# EasyEDA schematic Monitoring System_schematics.json
TITLE: Sheet_2; REV: 1.0; Date: 2024-05-09; Sheet: 1/1; Drawn By: martin.tab24; Company: Your Company
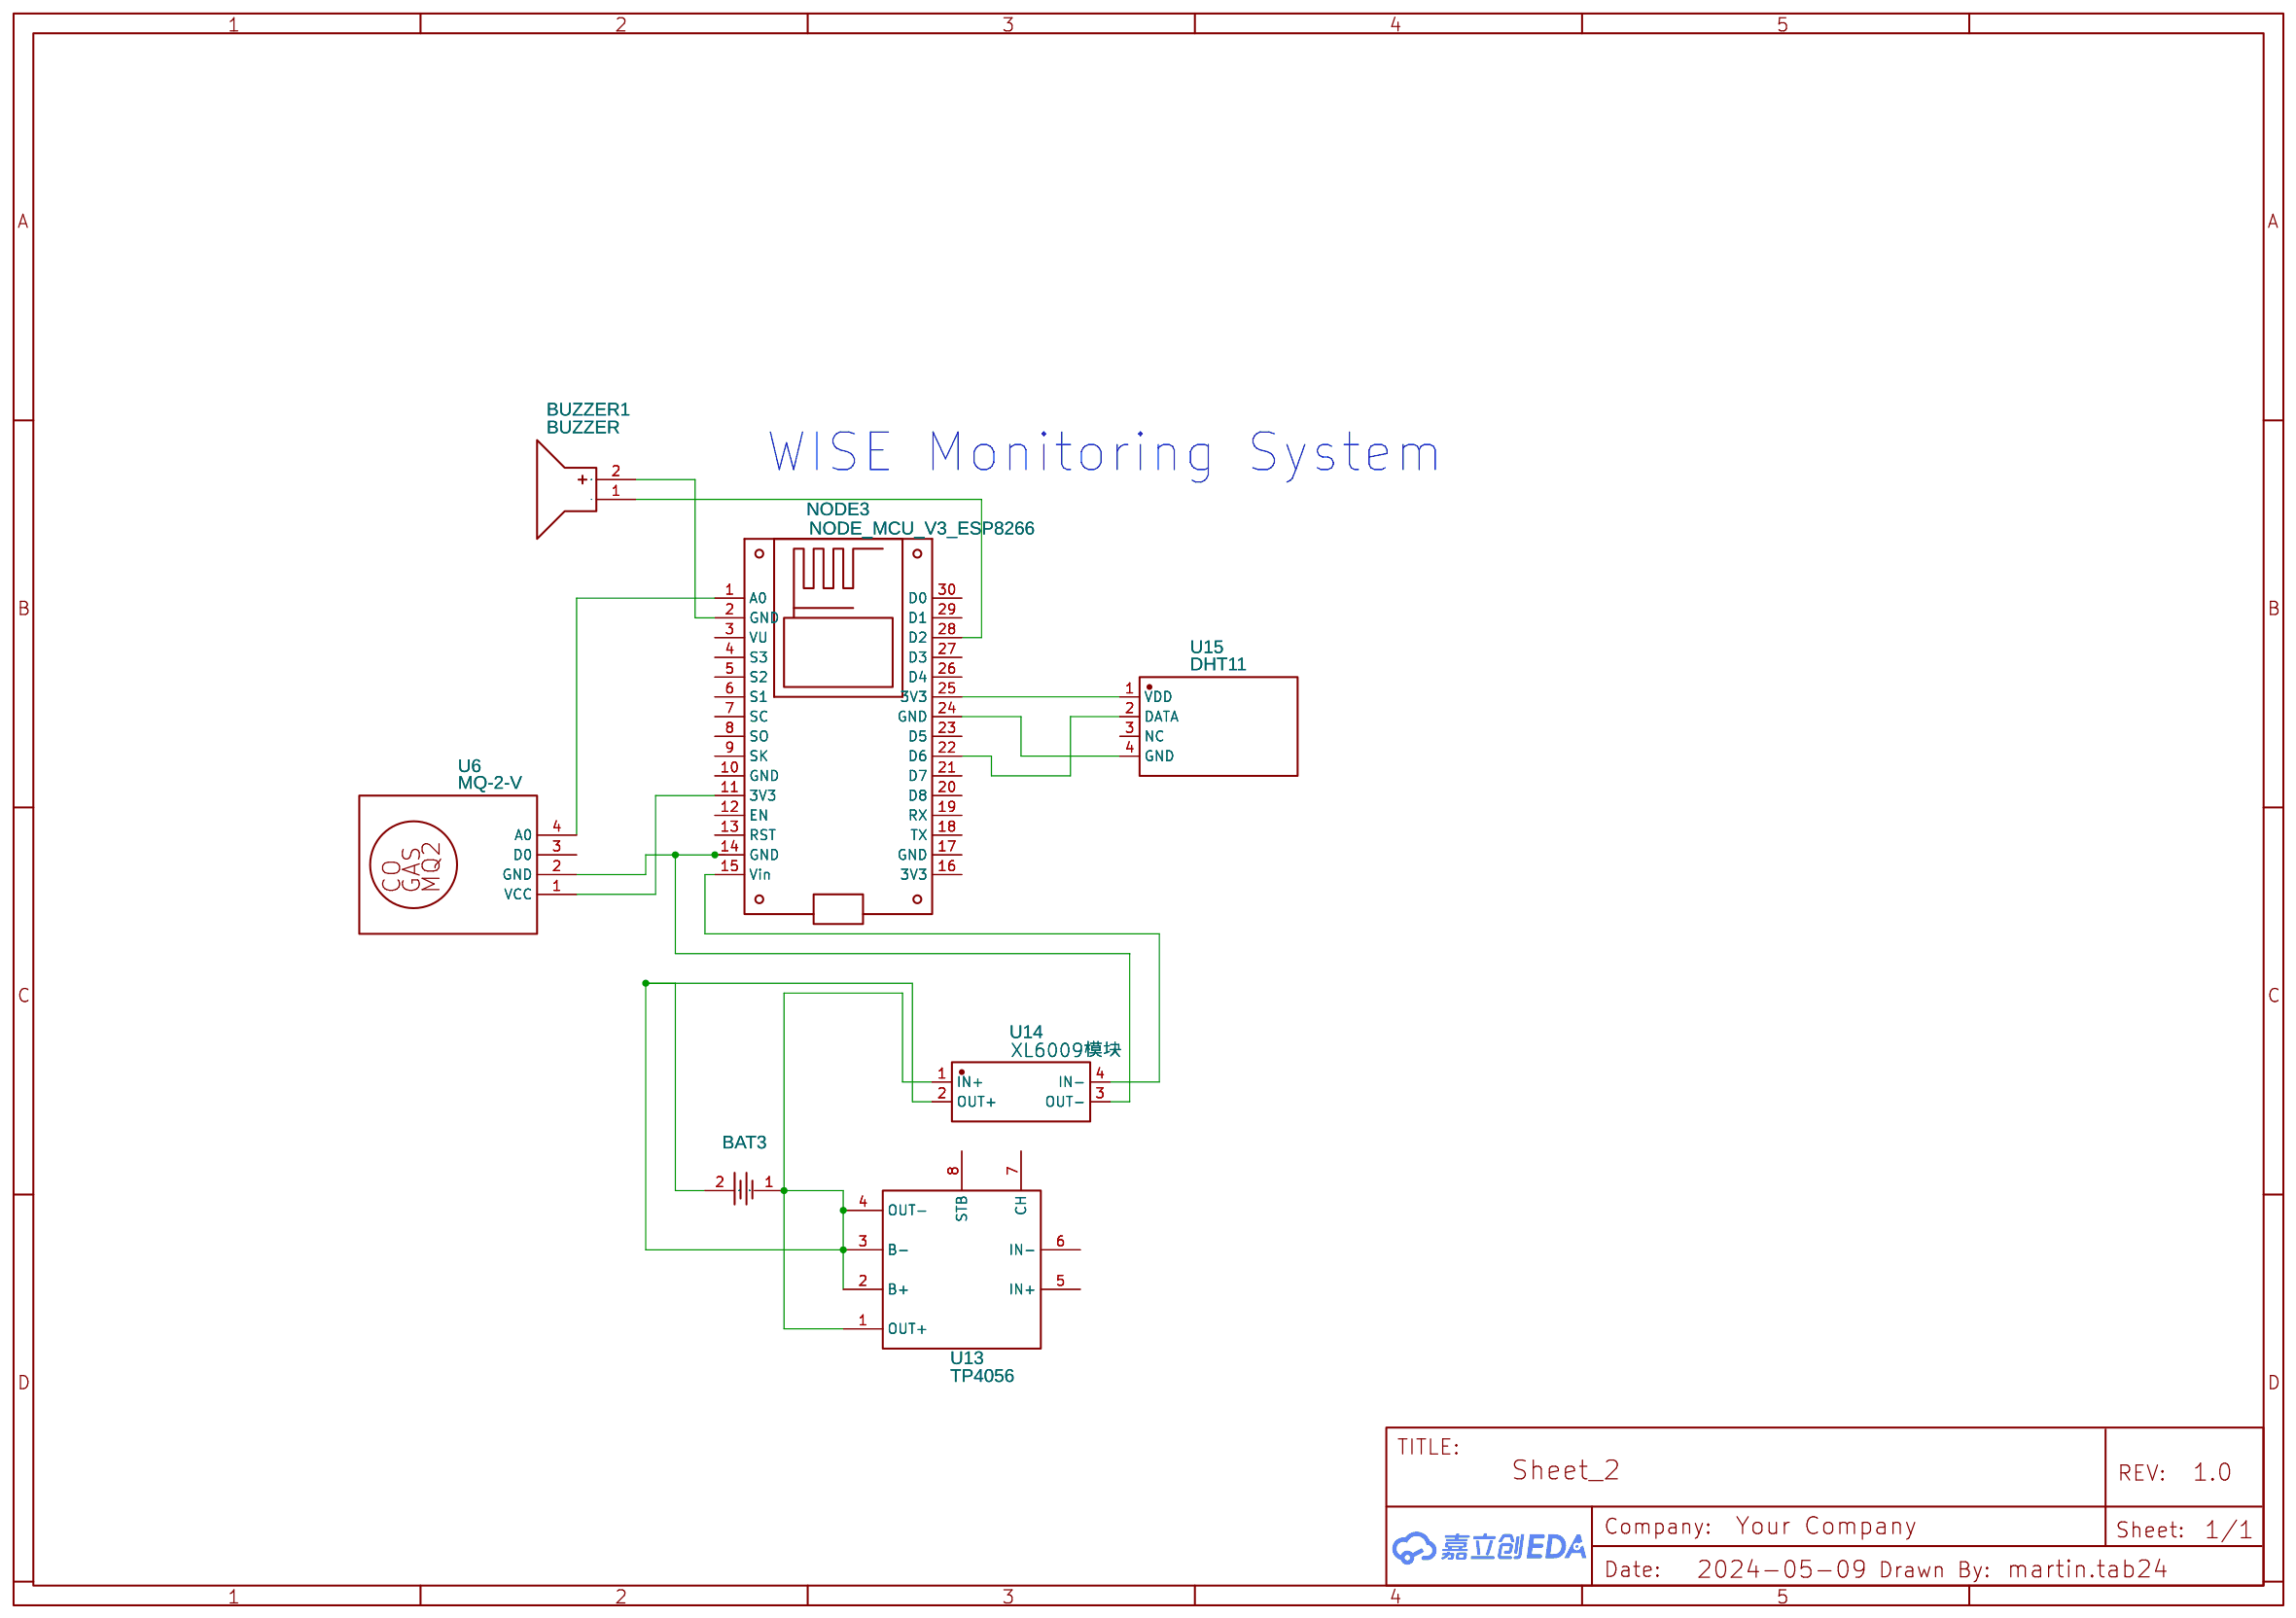
[diagram p0: schematic sheet]

## Parts
BAT3  BH-18650-B6AA002  [BATTERY-SMD_18650-1S-L77.1-W20.7-1]
BUZZER1  BUZZER  [BUZ-TH_BD12.0-P6.00-D0.9-RD]
NODE3  NODE_MCU_V3_ESP8266  [NODEMCU-12E;NODEMCU-ESP8266]
U6  MQ-2-V  [MQ-2-V]
U13  TP4056  [TP4056PCB]
U14  XL6009模块  [XFMR-SMD_XL6009]
U15  DHT11  [SENSOR-TH_DHT11]

## Library data of the parts
BAT3 = BH-18650-B6AA002: Supplier: LCSC; Supplier Part: C7525438; Manufacturer: MYOUNG(美阳); JLCPCB Part Class: Extended Part; Contributor: lcsc
BUZZER1 = BUZZER: Contributor: lcsc; Supplier: LCSC; Supplier Part: C9900014030; Manufacturer: null; JLCPCB Part Class: Extended Part
NODE3 = NODE_MCU_V3_ESP8266: Contributor: 1931120074; Supplier: TME
U6 = MQ-2-V: Manufacturer: Flying Fish; Supplier: Mercado Livre; Contributor: marcwebschiller
U13 = TP4056: Manufacturer Part: New SchematicLib; Contributor: kors20
U14 = XL6009模块: Contributor: LCSC; Supplier: LCSC; Supplier Part: C2908146; Manufacturer: null; JLCPCB Part Class: Extended Part
U15 = DHT11: Contributor: LCSC; Supplier: LCSC; Supplier Part: C117051; Manufacturer: 广州奥松; JLCPCB Part Class: Extended Part

## Nets
Net-(BAT3-1): BAT3.1 BAT3.2 U13.1(OUT+) U13.2(B+) U13.3(B-) U13.4(OUT-) U14.1(IN+) U14.2(OUT+)
Net-(BUZZER1-1): BUZZER1.1(-) NODE3.28(D2)
Net-(BUZZER1-2): BUZZER1.2(+) NODE3.2(GND)
Net-(NODE3-1): NODE3.1(A0) U6.4(A0)
Net-(NODE3-11): NODE3.11(3V3) U6.1(VCC)
Net-(NODE3-14): NODE3.14(GND) U6.2(GND) U14.3(OUT-)
Net-(NODE3-15): NODE3.15(Vin) U14.4(IN-)
Net-(NODE3-22): NODE3.22(D6) U15.2(DATA)
Net-(NODE3-24): NODE3.24(GND) U15.4(GND)
Net-(NODE3-25): NODE3.25(3V3) U15.1(VDD)

Not connected (* = marked no-connect by the designer): NODE3 3(VU) 4(S3) 5(S2) 6(S1) 7(SC) 8(SO) 9(SK) 10(GND) 12(EN) 13(RST) 16(3V3) 17(GND) 18(TX) 19(RX) 20(D8) 21(D7) 23(D5) 26(D4) 27(D3) 29(D1) 30(D0); U6 3(D0); U13 5(IN+) 6(IN-) 7(CH) 8(STB); U15 3(NC)

## Notes on the sheet
- WISE Monitoring System
